# EAGLE schematic POC_sensor_schematic (EAGLE 9.6.2)
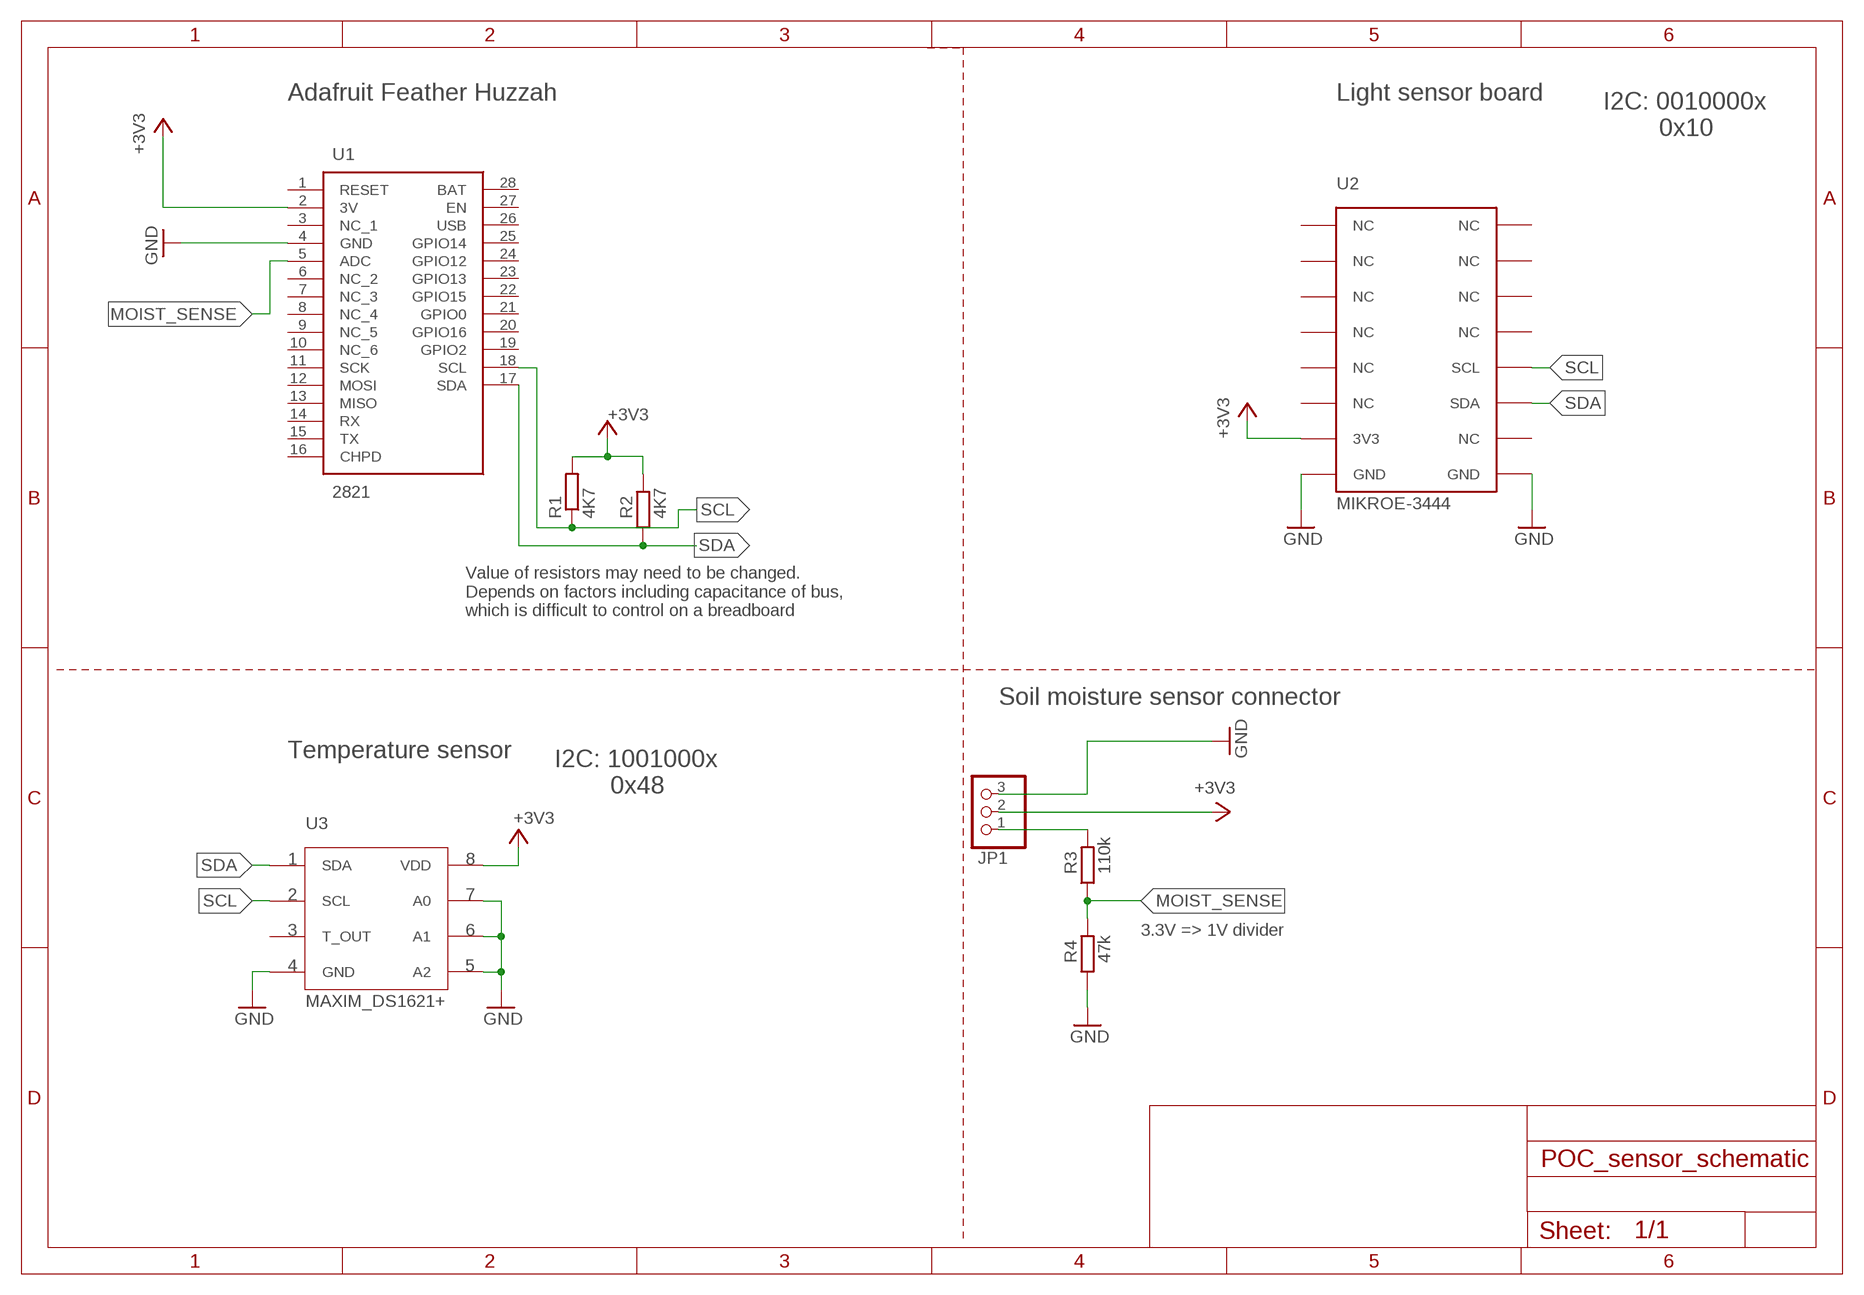
[diagram p0: schematic, sheet 1]

## Parts
JP1  PINHD-1X3  [1X03]
R1  4K7  R-EU_0204/5  [0204/5]
R2  4K7  R-EU_0204/5  [0204/5]
R3  110k  R-EU_0204/5  [0204/5]
R4  47k  R-EU_0204/5  [0204/5]
U1  2821  [2821]
U2  MIKROE-3444  (no package)
U3  MAXIM_DS1621+  (no package)

## Nets
+3V3: JP1.2 R1.2 R2.2 U1.2(3V) U2.3V3 U3.VDD
GND: JP1.3 R4.1 U1.4(GND) U2.GND U3.A0 U3.A1 U3.A2 U3.GND
MOIST_SENSE: R3.1 R4.2 U1.5(ADC)
N$2: JP1.1 R3.2
SCL: R1.1 U1.18(SCL) U2.SCL U3.SCL
SDA: R2.1 U1.17(SDA) U2.SDA U3.SDA
Unconnected: U1.1(RESET) U1.3(NC_1) U1.6(NC_2) U1.7(NC_3) U1.8(NC_4) U1.9(NC_5) U1.10(NC_6) U1.11(SCK) U1.12(MOSI) U1.13(MISO) U1.14(RX) U1.15(TX) U1.16(CHPD) U1.19(GPIO2) U1.20(GPIO16) U1.21(GPIO0) U1.22(GPIO15) U1.23(GPIO13) U1.24(GPIO12) U1.25(GPIO14) U1.26(USB) U1.27(EN) U1.28(BAT) U2.NC U3.T_OUT

## Notes on the sheet
- Adafruit Feather Huzzah | Light sensor board
- I2C: 0010000x
          0x10
- Value of resistors may need to be changed.
  Depends on factors including capacitance of bus,
  which is difficult to control on a breadboard
- Soil moisture sensor connector
- Temperature sensor
- I2C: 1001000x
          0x48
- 3.3V => 1V divider

## Library data of the parts
JP1 = pinhead:PINHD-1X3: PIN HEADER
R1-R4 = rcl:R-EU_: RESISTOR, European symbol; SPICEPREFIX: R
U1 = 2821:2821: ADAFRUIT - 2821 - Adafruit Feather HUZZAH ESP8266 Source: Datasheet <https://cdn-learn.adafruit.com/downloads/pdf/adafruit-feather-huzzah-esp8266.pdf>; ARROW_PART_NUMBER: 2821; ARROW_PRICE-STOCK: https://www.arrow.com/en/products/2821/adafruit-industries; DESCRIPTION: ADAFRUIT - 2821 - Adafruit Feather HUZZAH ESP8266; HEIGHT: 4mm; MANUFACTURER_NAME: Adafruit; MANUFACTURER_PART_NUMBER: 2821; MOUSER_PART_NUMBER: 485-2821; MOUSER_PRICE-STOCK: https://www.mouser.co.uk/ProductDetail/Adafruit/2821?qs=xE9dPqTLfL5V1q3xfEeZFw%3D%3D
U2 = Device_parts:MIKROE-3444
U3 = DS1621+:MAXIM_DS1621+